# EAGLE design nRF51822 (EAGLE 6.5.0)
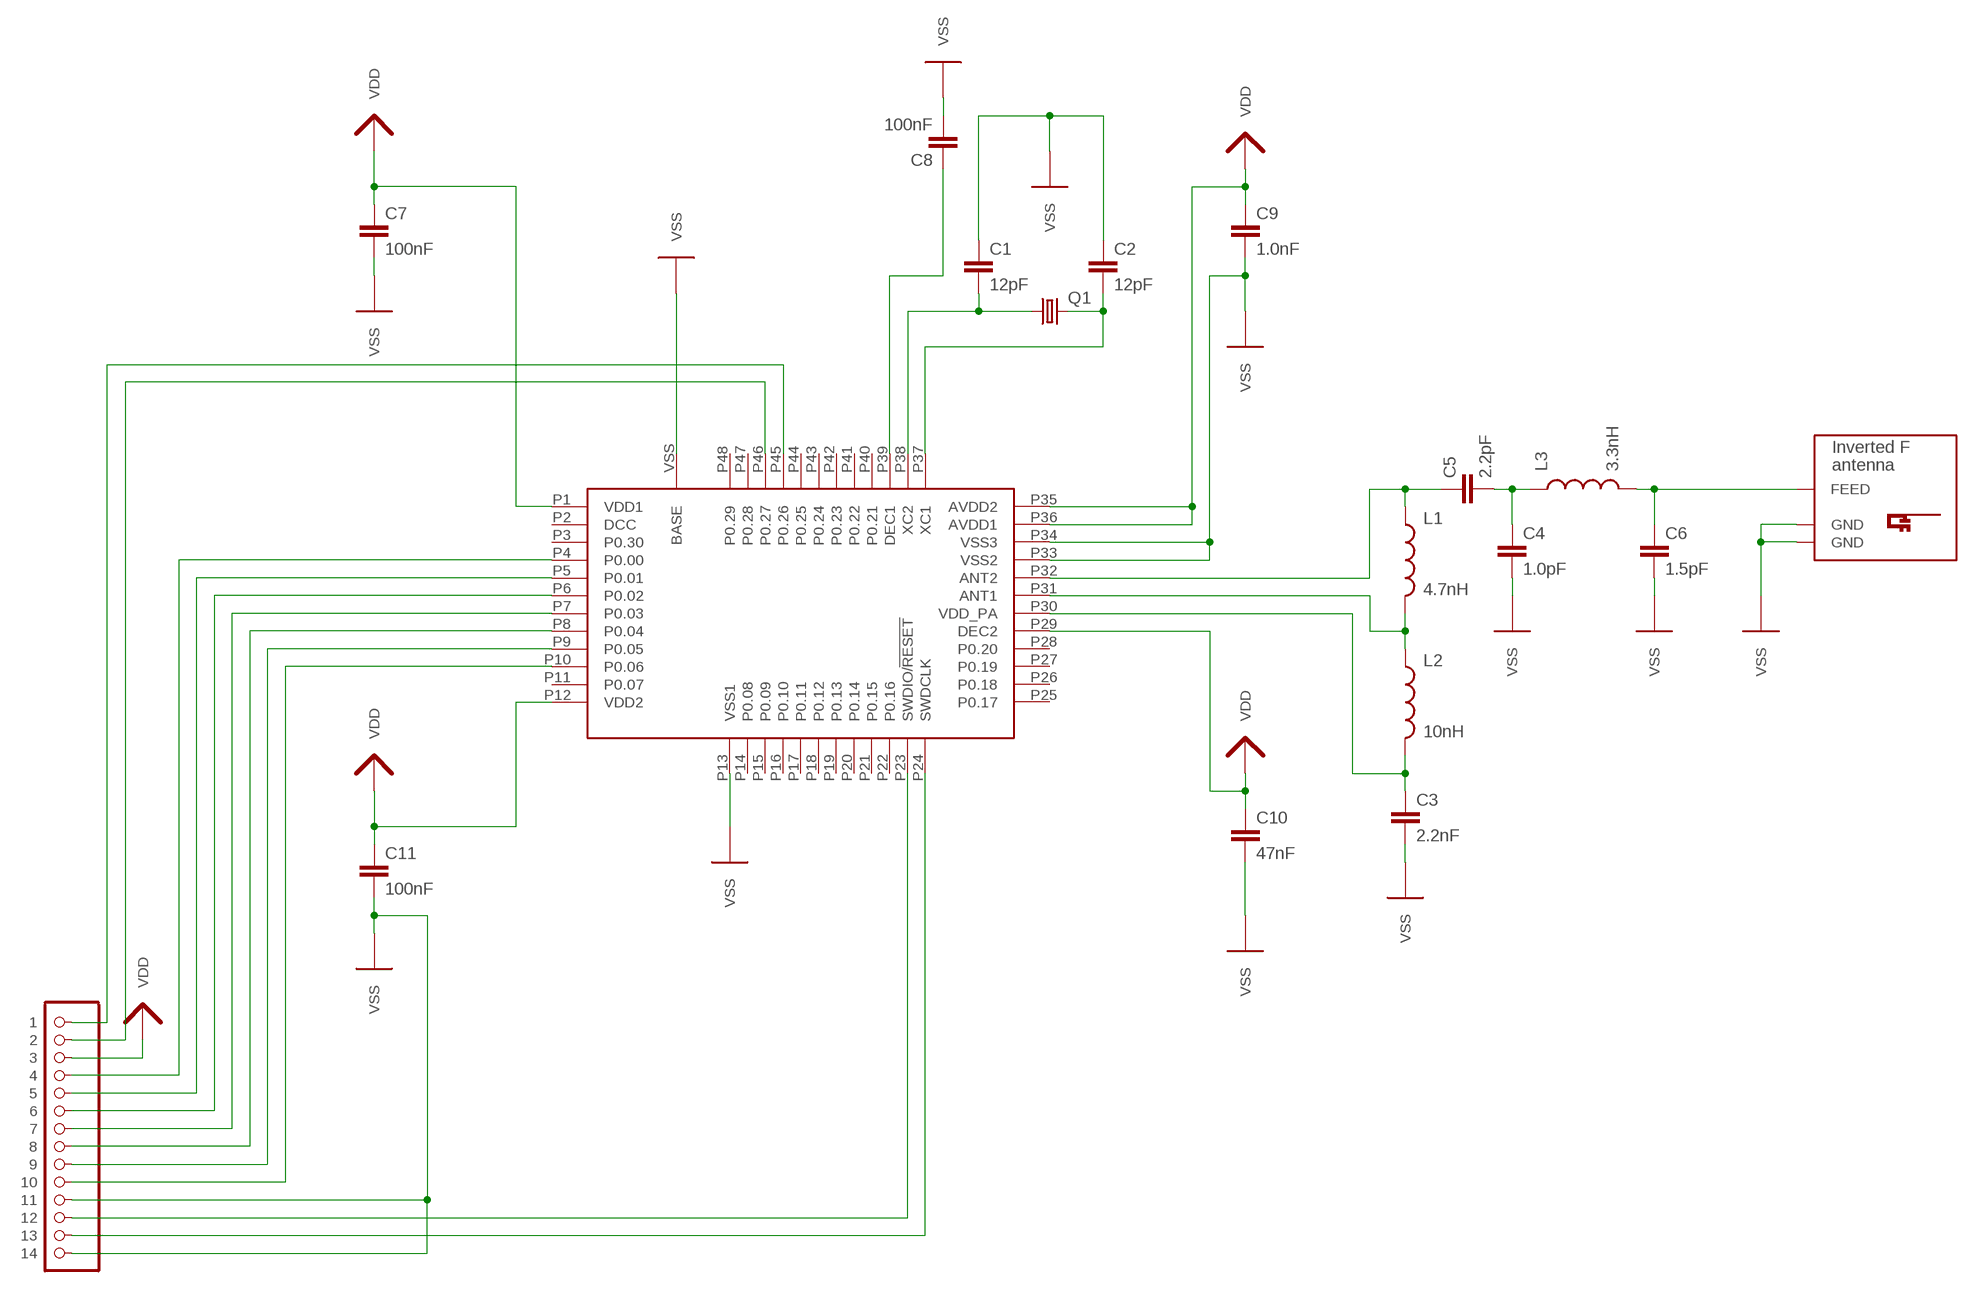
[diagram p0: schematic, sheet 1]

## Parts
C1  12pF  CAP0805  [0805]
C2  12pF  CAP0805  [0805]
C3  2.2nF  CAP0805  [0805]
C4  1.0pF  CAP0805  [0805]
C5  2.2pF  CAP0805  [0805]
C6  1.5pF  CAP0805  [0805]
C7  100nF  CAP0805  [0805]
C8  100nF  CAP0805  [0805]
C9  1.0nF  CAP0805  [0805]
C10  47nF  CAP0805  [0805]
C11  100nF  CAP0805  [0805]
L1  4.7nH  INDUCTOR0805  [0805]
L2  10nH  INDUCTOR0805  [0805]
L3  3.3nH  INDUCTOR0805  [0805]
Q1  FC-12M  [FC-12M]
U1  nRF51822  NRF51822  [QFN48]
U$2  INVERTED_F_ANTENNA+2  [DN007+2]
U$3  PINHD-1X14  [1X14]

## Nets
N$1: C1.2 Q1.1 U1.P38(XC2)
N$2: C2.2 Q1.2 U1.P37(XC1)
N$3: C3.1 L2.2 U1.P30(VDD_PA)
N$4: U1.P45(P0.26) U$3.1
N$5: C8.1 U1.P39(DEC1)
N$6: C5.1 L1.1 U1.P32(ANT2)
N$7: C4.1 C5.2 L3.1
N$8: C6.1 L3.2 U$2.FEED
N$9: U1.P46(P0.27) U$3.2
N$10: U1.P4(P0.00) U$3.4
N$11: U1.P5(P0.01) U$3.5
N$12: L1.2 L2.1 U1.P31(ANT1)
N$13: U1.P6(P0.02) U$3.6
N$14: U1.P7(P0.03) U$3.7
N$15: U1.P8(P0.04) U$3.8
N$16: U1.P9(P0.05) U$3.9
N$17: U1.P10(P0.06) U$3.10
N$28: U1.P23(SWDIO/!RESET!) U$3.12
N$29: U1.P24(SWDCLK) U$3.13
VDD: C7.1 C9.1 C10.1 C11.1 U1.P1(VDD1) U1.P12(VDD2) U1.P29(DEC2) U1.P35(AVDD2) U1.P36(AVDD1) U$3.3
VSS: C1.1 C2.1 C3.2 C4.2 C6.2 C7.2 C8.2 C9.2 C10.2 C11.2 U1.P13(VSS1) U1.P33(VSS2) U1.P34(VSS3) U1.VSS(BASE) U$2.GND U$2.GND@1(GND) U$3.11 U$3.14
Unconnected: U1.P2(DCC) U1.P3(P0.30) U1.P11(P0.07) U1.P14(P0.08) U1.P15(P0.09) U1.P16(P0.10) U1.P17(P0.11) U1.P18(P0.12) U1.P19(P0.13) U1.P20(P0.14) U1.P21(P0.15) U1.P22(P0.16) U1.P25(P0.17) U1.P26(P0.18) U1.P27(P0.19) U1.P28(P0.20) U1.P40(P0.21) U1.P41(P0.22) U1.P42(P0.23) U1.P43(P0.24) U1.P44(P0.25) U1.P47(P0.28) U1.P48(P0.29)

## Library data of the parts
C1-C11 = SparkFun-Capacitors:CAP: Capacitor Standard 0603 ceramic capacitor, and 0.1" leaded capacitor.
L1-L3 = SparkFun-Passives:INDUCTOR: Inductors Basic Inductor/Choke - 0603 and 1206. Footprints are not proven and vary greatly between part numbers.
Q1 = Liams Library Mar 2014:FC-12M: Low profile crystal SMD Source: Kyocera CX5032GB (CX-53F)
U1 = nRF51822:NRF51822: NRF51822 Nordic Semiconductor 48 pin QFN Metric measurements....
U$2 = antenna:INVERTED_F_ANTENNA: 2.4GHz Inverted F Antenna Based on TI Design Note DN007
U$3 = Liams Library Mar 2014:PINHD-1X14

## Board
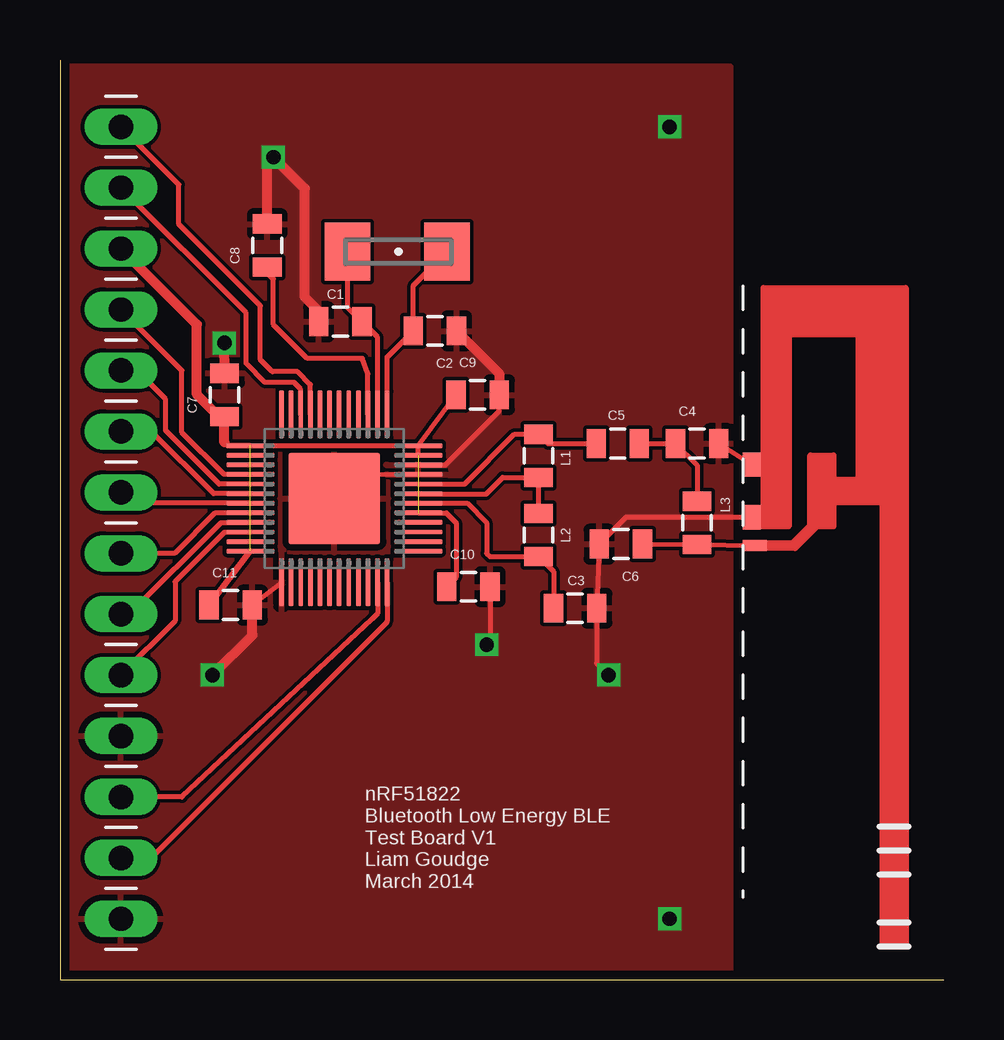
[diagram p1: board, top side]
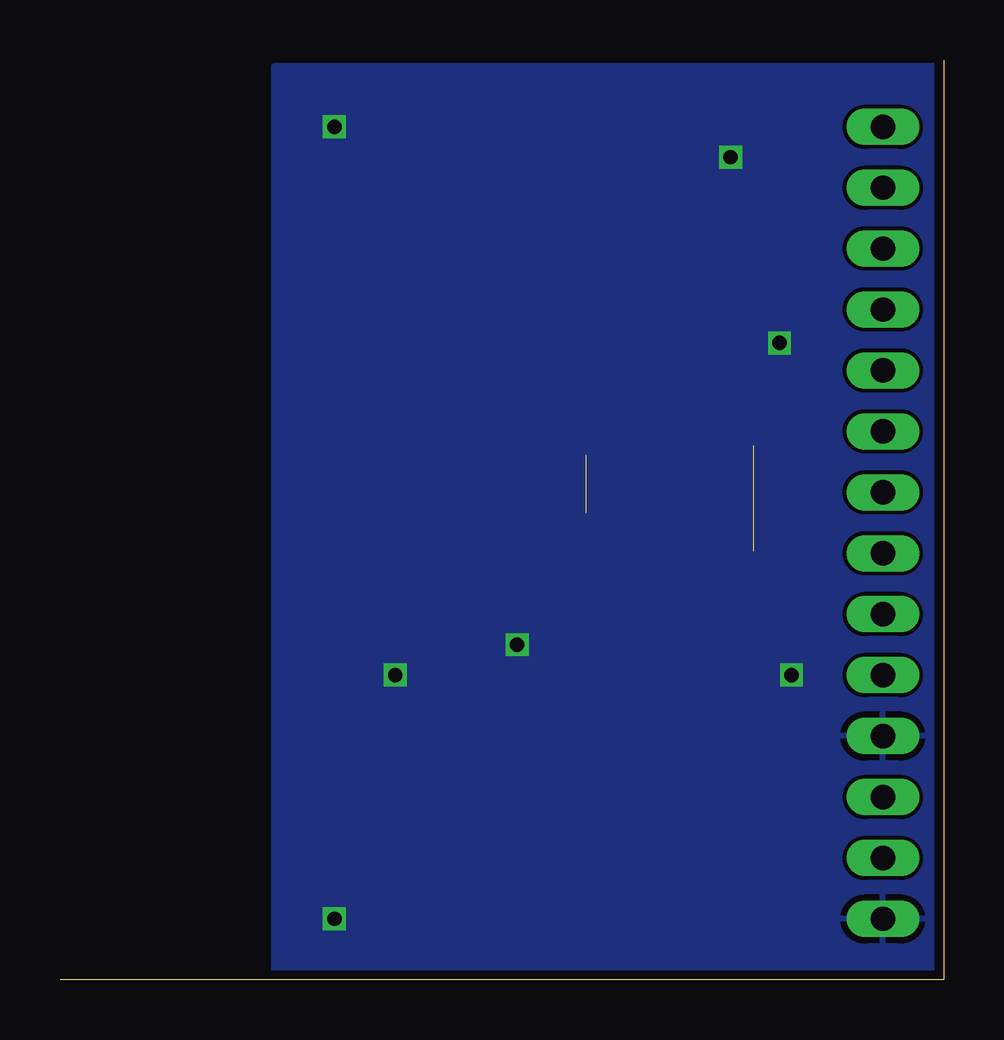
[diagram p2: board, bottom side, seen from below]

Size 36.83 x 38.34 mm. Coordinates in mm from the lower left corner, seen from the top.
Outline: 36.83,0 0,0 0,38.34
Copper layers (1*16): Top 0.0356mm / dielectric 1.5011mm / Bottom 0.0356mm
Design rules "LaenPCBOrder": minimum track width 6mil, minimum drill 13mil, track to track 6mil, track to pad 6mil, pad to pad 6mil, via to via 6mil, smd to smd 6mil, copper to edge 15mil, drill to drill 6mil, minimum pad ring 7mil, minimum via ring 7mil, stop-mask expansion 4mil, vias tented up to drill 0mil, thermal gap 10mil

### Footprints (pad centres in the part's own frame; a part is rotated, then mirrored left to right if it is on the bottom)
0805 = smd 0.8 x 1.2: 1 -0.9,0; 2 0.9,0
FC-12M = smd 1.905 x 2.4: 1 -2.12,0; 2 2.032,0
QFN48 = smd 2 x 0.2: P1 -3.5,2.2; P2 -3.5,1.8; P3 -3.5,1.4; P4 -3.5,1; P5 -3.5,0.6; P6 -3.5,0.2; P7 -3.5,-0.2; P8 -3.5,-0.6; P9 -3.5,-1; P10 -3.5,-1.4; P11 -3.5,-1.8; P12 -3.5,-2.2; P25 3.5,-2.2; P26 3.5,-1.8; P27 3.5,-1.4; P28 3.5,-1; P29 3.5,-0.6; P30 3.5,-0.2; P31 3.5,0.2; P32 3.5,0.6; P33 3.5,1; P34 3.5,1.4; P35 3.5,1.8; P36 3.5,2.2 | smd 0.2 x 2: P13 -2.2,-3.5; P14 -1.8,-3.5; P15 -1.4,-3.5; P16 -1,-3.5; P17 -0.6,-3.5; P18 -0.2,-3.5; P19 0.2,-3.5; P20 0.6,-3.5; P21 1,-3.5; P22 1.4,-3.5; P23 1.8,-3.5; P24 2.2,-3.5; P37 2.2,3.5; P38 1.8,3.5; P39 1.4,3.5; P40 1,3.5; P41 0.6,3.5; P42 0.2,3.5; P43 -0.2,3.5; P44 -0.6,3.5; P45 -1,3.5; P46 -1.4,3.5; P47 -1.8,3.5; P48 -2.2,3.5 | smd 3.81 x 3.81: VSS 0,0
DN007+2 = smd 0.46 x 1: FEED 2.22,-2.8 | smd 1.01 x 0.74: GND -1.16,-2.93; GND@1 1.035,-2.93
1X14 = drill 1.016 long: 1 -19.05,0; 2 -16.51,0; 3 -13.97,0; 4 -11.43,0; 5 -8.89,0; 6 -6.35,0; 7 -3.81,0; 8 -1.27,0; 9 1.27,0; 10 3.81,0; 11 6.35,0; 12 8.89,0; 13 11.43,0; 14 13.97,0

### Placement (x,y rotation side)
C1  11.68,27.43 0 top
C2  15.62,27.05 180 top
C3  21.46,15.49 0 top
C4  26.54,22.35 0 top
C5  23.24,22.35 0 top
C6  23.37,18.16 180 top
C7  6.86,24.38 90 top
C8  8.64,30.61 90 top
C9  17.4,24.38 0 top
C10  17.02,16.38 0 top
C11  7.11,15.62 0 top
L1  19.94,21.84 270 top
L2  19.94,18.54 270 top
L3  26.54,19.05 270 top
Q1  14.1,30.35 0 top
U1  11.43,20.07 0 top
U$2  31.75,20.32 270 top
U$3  2.54,16.51 270 top

### Tracks (layer width: path | path; a pad name or v marks a point on that pad's centre or on a via)
N$1
  Top 0.203: Q1.1 11.98,28.04 C1.2 13.23,26.79 U1.P38
N$2
  Top 0.203: U1.P37 13.63,25.96 C2.2 14.72,28.95 Q1.2
N$3
  Top 0.203: C3.1 20.56,17.02 L2.2 17.92,17.64 17.78,17.78 17.78,19.05 16.96,19.87 U1.P30
N$4
  Top 0.203: U1.P45 10.43,24.82 9.9,25.35 8.85,25.35 8.35,25.85 8.35,28.1 4.95,31.5 4.95,33.15 U$3.1
N$5
  Top 0.203: U1.P39 12.83,25.27 12.6,25.9 10.3,25.9 8.89,27.31 8.89,29.21 8.64,29.46 C8.1
N$6
  Top 0.203: C5.1 20.33,22.35 L1.1 18.93,22.74 16.86,20.67 U1.P32
N$7
  Top 0.203: C5.2 C4.1 26.54,21.45 L3.1
N$8
  Top 0.203: C6.1 L3.2 U$2.FEED
N$9
  Top 0.203: U1.P46 10.03,24.62 9.75,24.9 8.55,24.9 7.75,25.7 7.75,27.81 U$3.2
N$10
  Top 0.203: U1.P4 6.83,21.07 5.08,22.82 5.08,25.4 U$3.4
N$11
  Top 0.203: U1.P5 6.63,20.67 4.4,22.9 4.4,24.2 3.2,25.4 U$3.5
N$12
  Top 0.203: L2.1 L1.2 18.44,20.94 17.75,20.25 14.95,20.25 U1.P31
N$13
  Top 0.203: U1.P6 6.4,20.27 3.81,22.86 U$3.6
N$14
  Top 0.203: U1.P7 2.99,19.87 U$3.7
N$15
  Top 0.203: U1.P8 7.91,19.45 6.45,19.45 4.78,17.78 U$3.8
N$16
  Top 0.203: U1.P9 7.91,19.05 6.7,19.05 2.89,15.24 U$3.9
N$17
  Top 0.203: U1.P10 7.91,18.65 6.85,18.65 4.8,16.6 4.8,14.96 U$3.10
N$28
  Top 0.203: U1.P23 13.23,15.28 13,15.05 5.08,7.62 U$3.12
N$29
  Top 0.203: U1.P24 13.63,14.93 13.6,14.9 13.6,14.87 3.81,5.08 U$3.13
VDD  (2 unrouted)
  Top 0.203: U1.P36 U1.P1 6.98,22.27 6.85,22.4 | U1.P36 C9.1 | 6.86,23.34 C7.1 6.62,23.48 | U1.P35 U1.P36 | U1.P29 16.09,19.47 16.51,19.05 16.51,16.77 C10.1
  Top 0.254: C11.1 U1.P12
  Top 0.406: 6.85,22.4 C7.1 | 6.62,23.48 5.7,24.4 5.7,27.32 U$3.3
VSS  (via drill 0.6)
  Top 0.203: C4.2 U$2.GND | U$2.GND@1 23.59,19.29 C6.2 C3.2 22.36,13.2 v22.86,12.7 | U1.P34 14.95,21.45 16.05,21.45 18.3,23.7 C9.2 | C10.2 17.92,14.11 v17.78,13.97 | C7.2 6.35,25.4 | C1.1 10.78,27.87 | U1.P33 13.1,21.05 U1.VSS | C11.2 U1.P13
  Top 0.406: C2.1 18.3,25.27 C9.2 | v6.35,12.7 8.01,14.36 C11.2 | C7.2 v6.85,26.55 | C8.2 8.64,34.04 v8.89,34.29 10.2,32.98 10.2,28.45 10.78,27.87
  other vias: 25.4,35.56 25.4,2.54
  pour Bottom: 0,38.1 27.94,38.1 27.94,0 0,0
  pour Top: 0,38.1 27.94,38.1 27.94,0 0,0

### Text on the board
_tsilk: nRF51822 / Bluetooth Low Energy BLE / Test Board V1 / Liam Goudge / March 2014